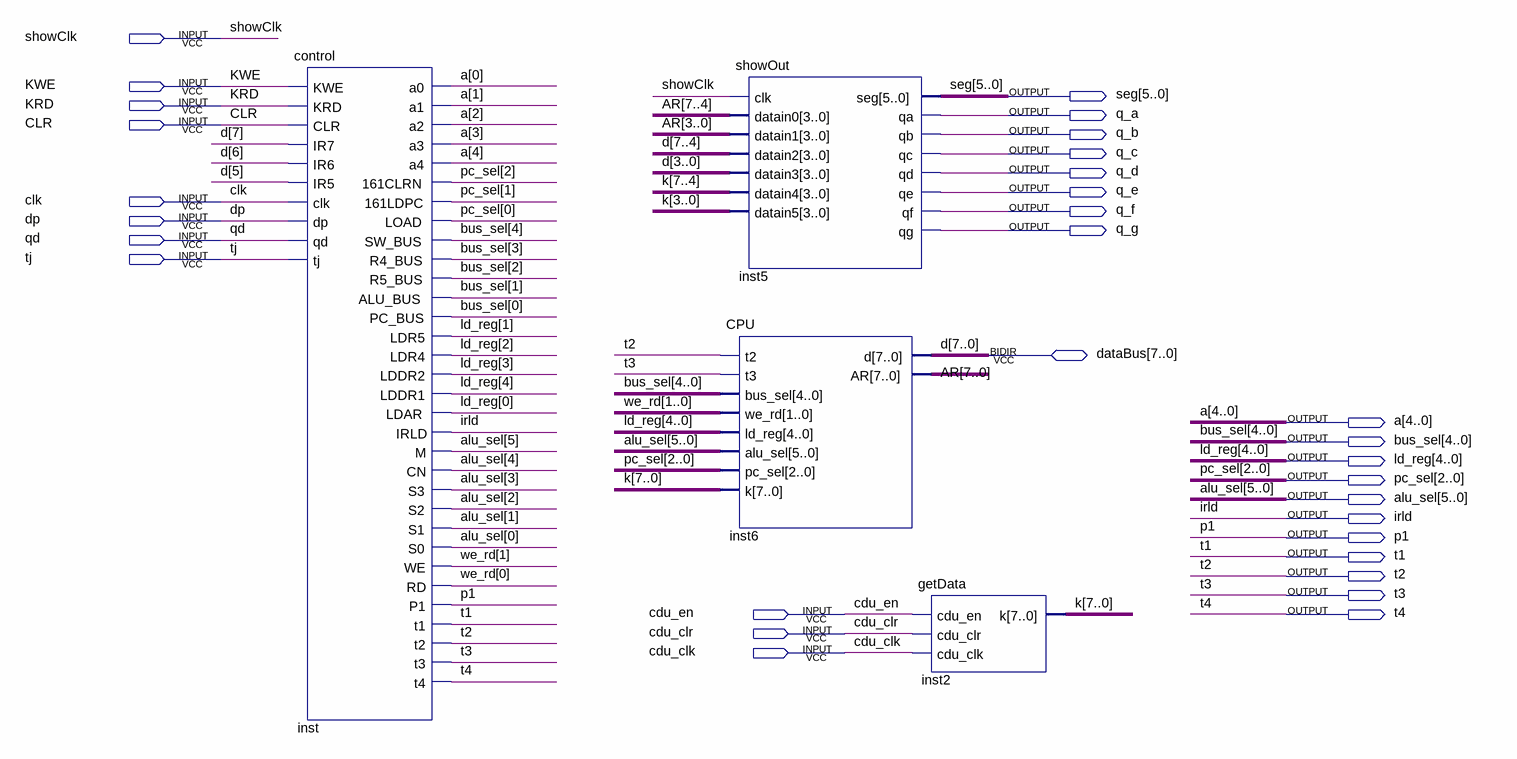
[diagram p0: schematic sheet]
// Quartus schematic modelCPU.bdf as structural Verilog: 4 symbols, 31 pins
module modelCPU (
  input  showClk,
  input  KWE,
  input  KRD,
  input  CLR,
  input  clk,
  input  dp,
  input  qd,
  input  tj,
  input  cdu_en,
  input  cdu_clr,
  input  cdu_clk,
  inout  [7:0] dataBus,
  output [5:0] seg,
  output q_a,
  output q_b,
  output q_c,
  output q_d,
  output q_e,
  output q_f,
  output q_g,
  output [4:0] a,
  output [4:0] bus_sel,
  output [4:0] ld_reg,
  output [2:0] pc_sel,
  output [5:0] alu_sel,
  output irld,
  output p1,
  output t1,
  output t2,
  output t3,
  output t4
);

  wire [1:0] we_rd;
  wire [7:0] AR, k;

  control inst (
    .KWE(KWE), .KRD(KRD), .CLR(CLR), .IR7(dataBus[7]), .IR6(dataBus[6]), .IR5(dataBus[5]), .clk(clk),
    .dp(dp), .qd(qd), .tj(tj), .a0(a[0]), .a1(a[1]), .a2(a[2]), .a3(a[3]), .a4(a[4]), .\161CLRN (pc_sel[2]),
    .\161LDPC (pc_sel[1]), .LOAD(pc_sel[0]), .SW_BUS(bus_sel[4]), .R4_BUS(bus_sel[3]), .R5_BUS(bus_sel[2]),
    .ALU_BUS(bus_sel[1]), .PC_BUS(bus_sel[0]), .LDR5(ld_reg[1]), .LDR4(ld_reg[2]), .LDDR2(ld_reg[3]),
    .LDDR1(ld_reg[4]), .LDAR(ld_reg[0]), .IRLD(irld), .M(alu_sel[5]), .CN(alu_sel[4]), .S3(alu_sel[3]),
    .S2(alu_sel[2]), .S1(alu_sel[1]), .S0(alu_sel[0]), .WE(we_rd[1]), .RD(we_rd[0]), .P1(p1), .t1(t1),
    .t2(t2), .t3(t3), .t4(t4));
  CPU inst6 (
    .t2(t2), .t3(t3), .bus_sel(bus_sel), .we_rd(we_rd), .ld_reg(ld_reg), .alu_sel(alu_sel), .pc_sel(pc_sel),
    .k(k), .AR(AR), .d(dataBus));
  showOut inst5 (
    .clk(showClk), .datain0(AR[7:4]), .datain1(AR[3:0]), .datain2(dataBus[7:4]), .datain3(dataBus[3:0]),
    .datain4(k[7:4]), .datain5(k[3:0]), .seg(seg), .qa(q_a), .qb(q_b), .qc(q_c), .qd(q_d), .qe(q_e),
    .qf(q_f), .qg(q_g));
  getData inst2 (.cdu_en(cdu_en), .cdu_clr(cdu_clr), .cdu_clk(cdu_clk), .k(k));

  // Other names for the same wires on the sheet: d[7:0] = dataBus
endmodule
